# Altium schematic sheet 1_P1.schdoc
size 604 x 431 mm; Symbol: Sheet-Symbol_A2; Device: Sheet-Symbol_A2; @Project Name: LOOK_NT5510_屏幕驱动; @Page Count: 1; @Update Date: 2022-09-19; @Create Date: 2022-08-04; @Schematic Name: Schematic1; @Page No: 1; @Page Name: P1
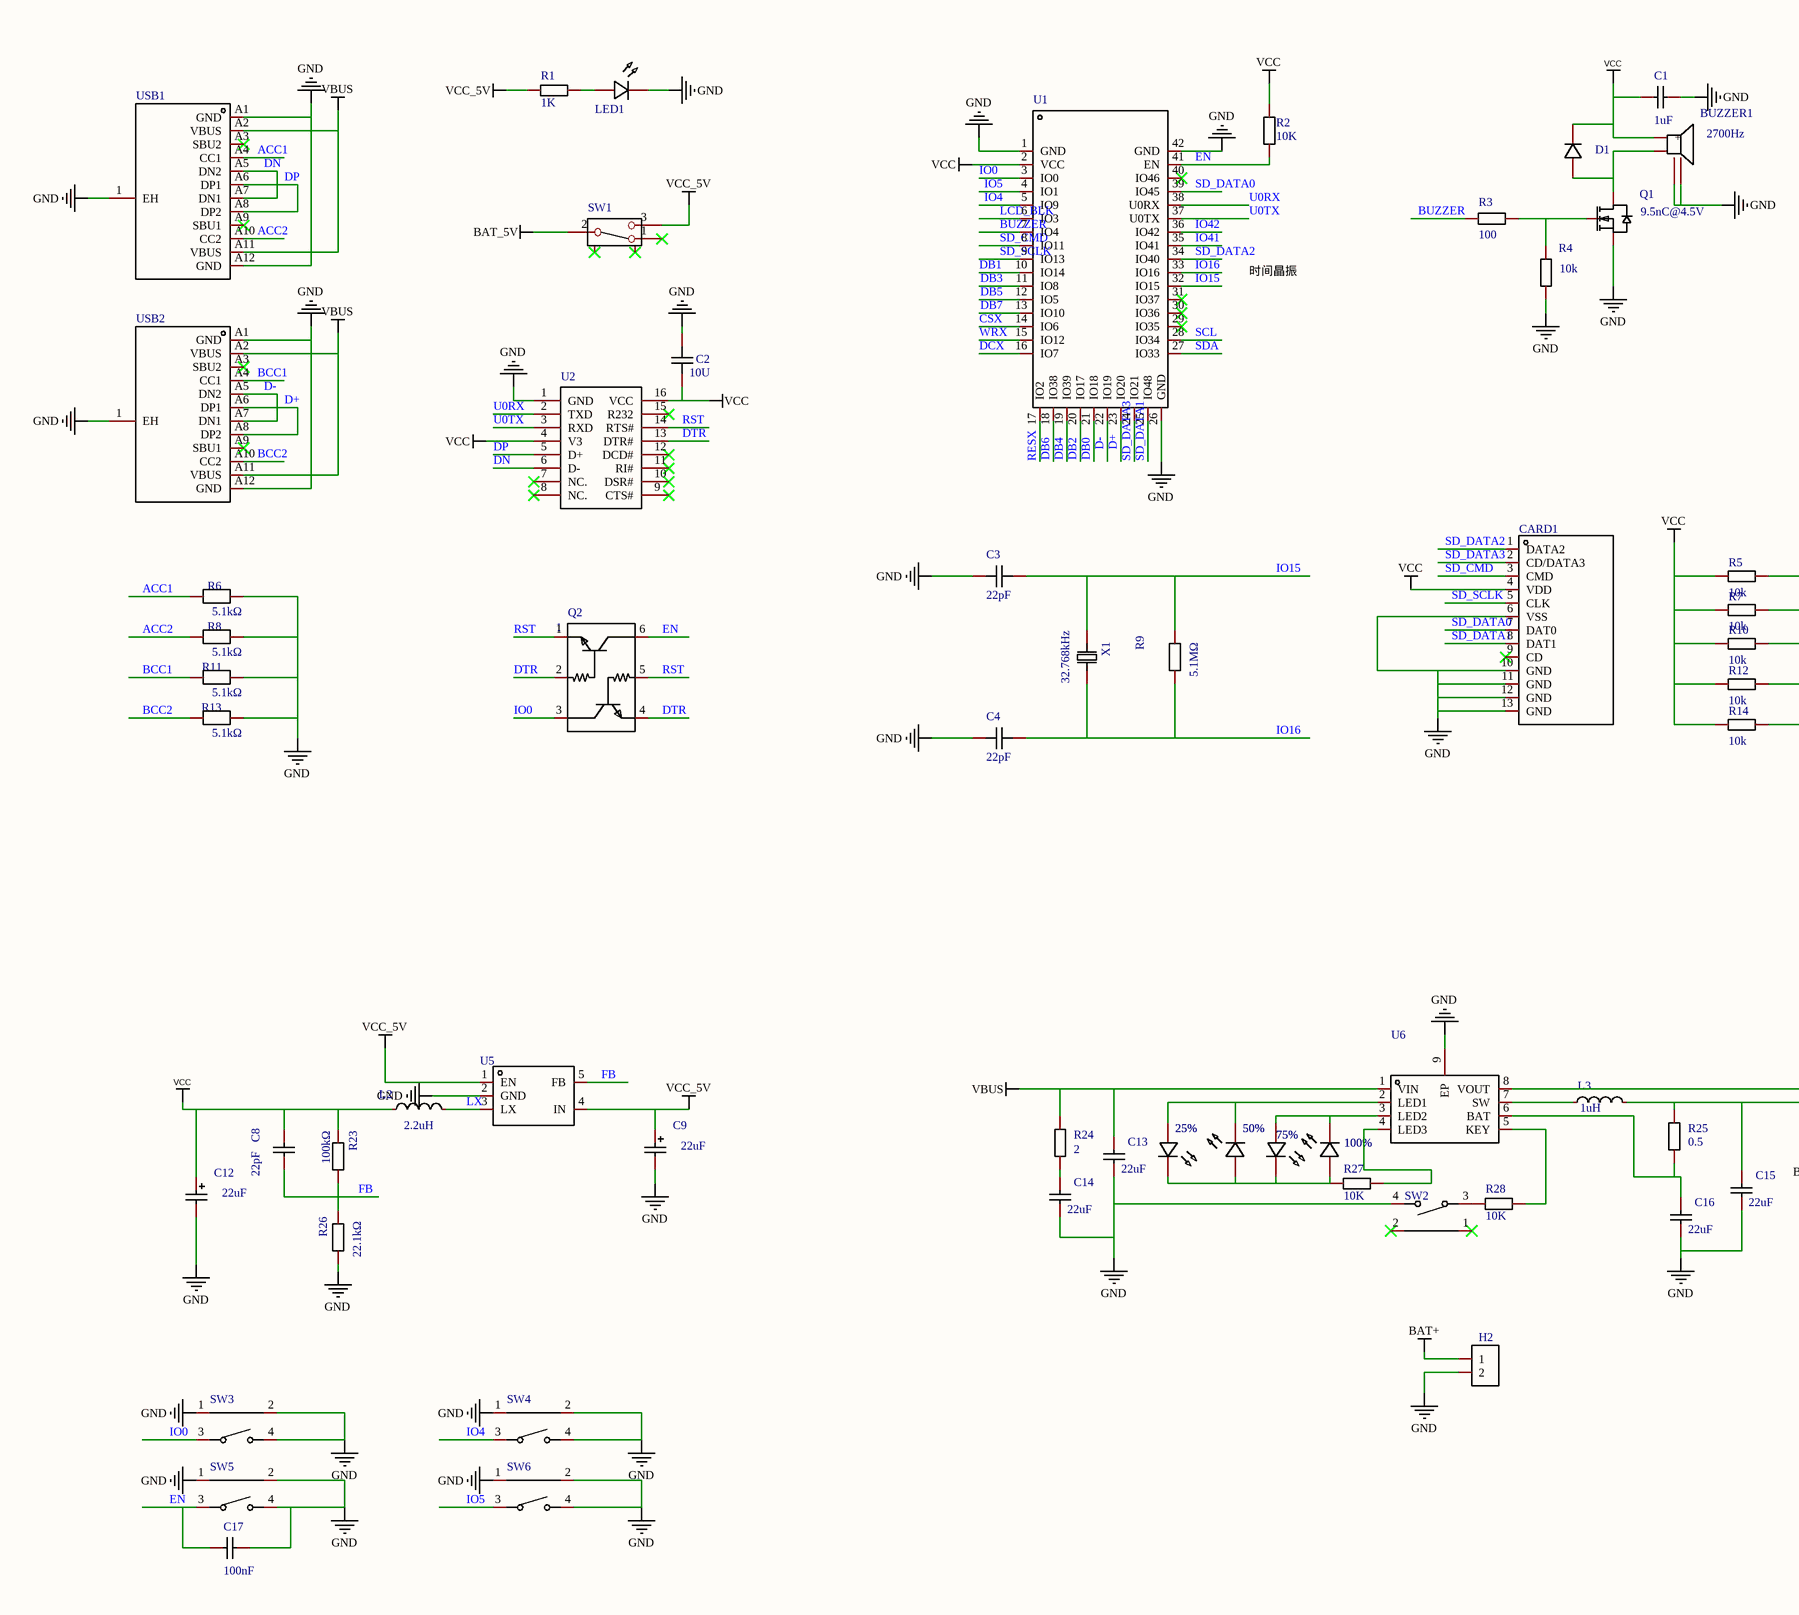
[diagram p0: 1_P1.schdoc, left]
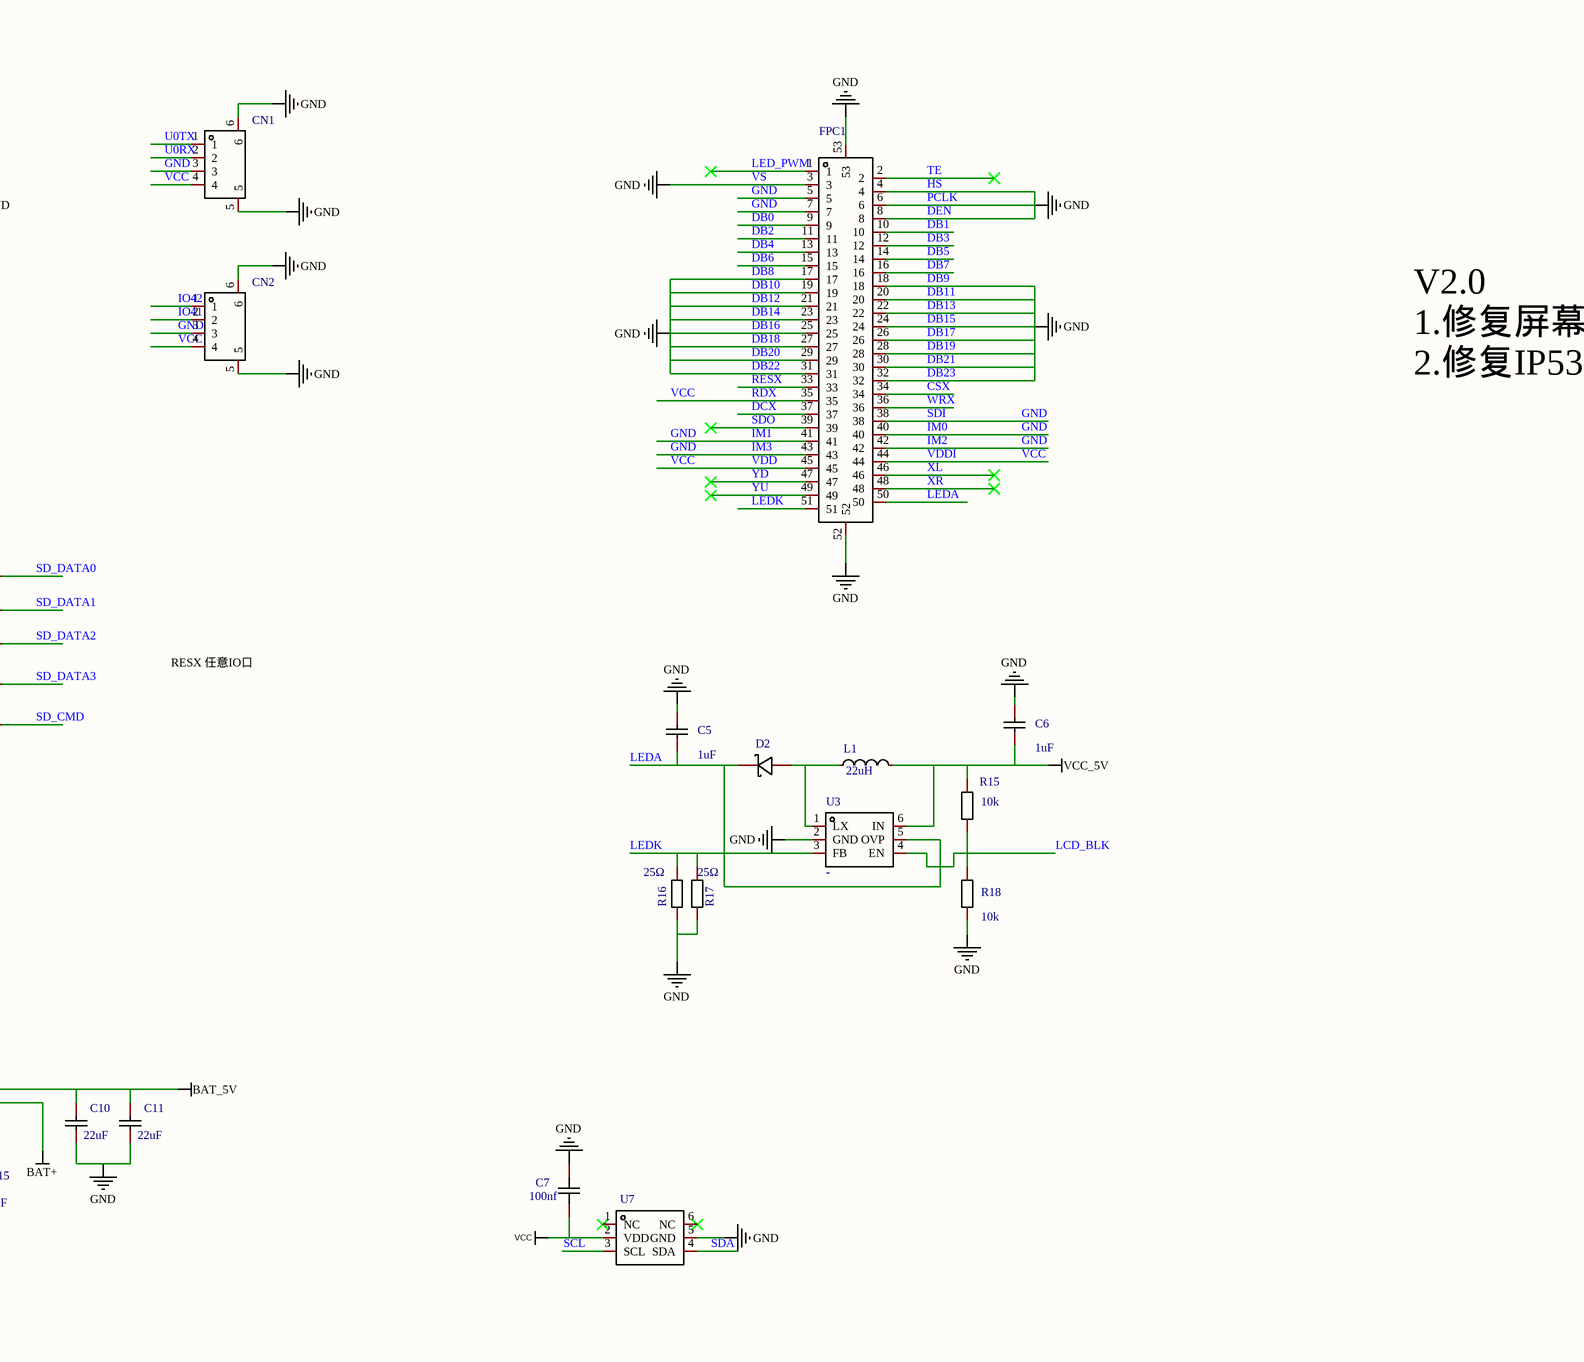
[diagram p1: 1_P1.schdoc, right]

## Parts
BUZZER1  value 2700Hz  [BUZ-SMD_4P-L8.5-W8.5-P8.50-TL]  (hidden comment: MLT-8530)
C1  value 1uF  [C0603]  (hidden comment: CL10A105KO8NNNC)
C2  value 10U  [C0603]  (hidden comment: CAP_0603)
C3  value 22pF  [C0603]  (hidden comment: CAP_0603)
C4  value 22pF  [C0603]  (hidden comment: CAP_0603)
C5  value 1uF  [C0603]  (hidden comment: CL10A105KO8NNNC)
C6  value 1uF  [C0603]  (hidden comment: CL10A105KO8NNNC)
C7  value 100nf  [C0603]  (hidden comment: CAP_0603)
C8  value 22pF  [C0603]  (hidden comment: cc0603jrnpo9bn220)
C9  value 22uF  [CAP-SMD_L3.5-W2.8-R-RD]  (hidden comment: TAJB226K016RNJ)
C10  value 22uF  [C0603]  (hidden comment: CL10A105KO8NNNC)
C11  value 22uF  [C0603]  (hidden comment: CL10A105KO8NNNC)
C12  value 22uF  [CAP-SMD_L3.5-W2.8-R-RD]  (hidden comment: TAJB226K016RNJ)
C13  value 22uF  [C0603]  (hidden comment: CL10A105KO8NNNC)
C14  value 22uF  [C0603]  (hidden comment: CL10A105KO8NNNC)
C15  value 22uF  [C0603]  (hidden comment: CL10A105KO8NNNC)
C16  value 22uF  [C0603]  (hidden comment: CL10A105KO8NNNC)
C17  value 100nF  [C0603]  (hidden comment: 0603B104K500NT)
CARD1  tf-115-bcp9  [TF-SMD_TF-115-BCP9]  (value not drawn)
CN1  PH-4P卧贴  [CONN-SMD_PH2.0-4PWB]  (value not drawn)
CN2  PH-4P卧贴  [CONN-SMD_PH2.0-4PWB]  (value not drawn)
D1  1N4148W  [SOD-123_L2.8-W1.8-LS3.7-RD]  (value not drawn)
D2  SS34  [DO-214AC_L4.3-W2.7-LS5.3-RD]  (value not drawn)
FPC1  FH26W-51S-0.3SHW(60)  [FPC-SMD_FH26W-51S-0.3SHW-60]  (value not drawn)
H2  HDR-F_2.54_1x2P  [HDR-TH_2P-P2.54-V-F]  (value not drawn)
L1  value 22uH  [IND-SMD_L5.0-W5.0]  (hidden comment: SWPA5040S220MT)
L2  value 2.2uH  [IND-SMD_L4.4-W4.2]  (hidden comment: SLO0420H2R2MTT)
L3  value 1uH  [IND-SMD_L7.1-W6.5-P5.60]  (hidden comment: SPM6530T-1R0M120)
LED1  LED_0603-R  [LED0603-RD_BLUE]  (value not drawn)
LED4  100%  [LED0603-RD_BLUE]
LED5  25%  [LED0603-RD_BLUE]
LED6  50%  [LED0603-RD_BLUE]
LED7  75%  [LED0603-RD_BLUE]
Q1  Total Gate Charge (Qg@Vgs): 9.5nC@4.5V  [SOT-23-3_L2.9-W1.3-P1.90-LS2.4-BR]  (hidden comment: AO3400)
Q2  NUMBER: 1  [SC-70-6_L2.2-W1.3-P0.65-LS2.1-BR]  (hidden comment: UMH3N)
R1  value 1K  [R0603]  (hidden comment: Res_0603)
R2  value 10K  [R0603]  (hidden comment: Res_0603)
R3  value 100  [R0603]  (hidden comment: RC0603FR-07100RL)
R4  value 10k  [R0603]  (hidden comment: RC0603FR-0710KL_1)
R5  value 10k  [R0603]  (hidden comment: 0603waf1002t5e)
R6  value 5.1kΩ  [R0603]  (hidden comment: td03g5101bt)
R7  value 10k  [R0603]  (hidden comment: 0603waf1002t5e)
R8  value 5.1kΩ  [R0603]  (hidden comment: td03g5101bt)
R9  value 5.1MΩ  [R0603]  (hidden comment: 0603WAJ0515T5E)
R10  value 10k  [R0603]  (hidden comment: 0603waf1002t5e)
R11  value 5.1kΩ  [R0603]  (hidden comment: td03g5101bt)
R12  value 10k  [R0603]  (hidden comment: 0603waf1002t5e)
R13  value 5.1kΩ  [R0603]  (hidden comment: td03g5101bt)
R14  value 10k  [R0603]  (hidden comment: 0603waf1002t5e)
R15  value 10k  [R0603]  (hidden comment: RC0603FR-0710KL_1)
R16  value 25Ω  [R0603]  (hidden comment: RC0603FR-0710KL_1)
R17  value 25Ω  [R0603]  (hidden comment: RC0603FR-0710KL_1)
R18  value 10k  [R0603]  (hidden comment: RC0603FR-0710KL_1)
R23  value 100kΩ  [R0603]  (hidden comment: rc0603fr-07100kl)
R24  value 2  [R0603]  (hidden comment: 0603waf1002t5e)
R25  value 0.5  [R0603]  (hidden comment: 0603waf1002t5e)
R26  value 22.1kΩ  [R0603]  (hidden comment: 0603waf2212t5e)
R27  value 10K  [R0603]  (hidden comment: 0603waf1002t5e)
R28  value 10K  [R0603]  (hidden comment: 0603waf1002t5e)
SW1  SK-12D02-VG5  [SW-TH_SK-12D02-VG5]  (value not drawn)
SW2  TS24CA  [SW-SMD_TS24CA]  (value not drawn)
SW3  TS24CA  [SW-SMD_TS24CA]  (value not drawn)
SW4  TS24CA  [SW-SMD_TS24CA]  (value not drawn)
SW5  TS24CA  [SW-SMD_TS24CA]  (value not drawn)
SW6  TS24CA  [SW-SMD_TS24CA]  (value not drawn)
U1  ESP-S3-12K  [WIFIM-SMD_42P-L31.0-W18.0-P1.50]  (value not drawn)
U2  CH340C  [SOP-16_L10.0-W3.9-P1.27-LS6.0-BL]  (value not drawn)
U3  RY3730  [SOT-23-6_L2.9-W1.6-P0.95-LS2.8-BL]  (value not drawn)
U5  sy8088aac  [SOT-23-5_L3.0-W1.7-P0.95-LS2.8-BR]  (value not drawn)
U6  IP5306  [ESOP-8_L4.9-W3.9-P1.27-LS6.0-BL-EP]  (value not drawn)
U7  AHT20  [SENSOR-SMD_L3.0-W3.0-P1.00-BR]  (value not drawn)
USB1  TYPE-C-2.0-16PIN-SMT-3  [TYPE-C-SMD_TYPE-CF3.1]  (value not drawn)
USB2  TYPE-C-2.0-16PIN-SMT-3  [TYPE-C-SMD_TYPE-CF3.1]  (value not drawn)
X1  value 32.768kHz  [FC-135R_L3.2-W1.5]  (hidden comment: Q13FC1350000400)

## Nets
BAT+: C15.2 H2.1 L3.2 R25.1
BAT_5V: C10.2 C11.2 SW1.2 U6.8(VOUT)
DB10: BUZZER1.3 BUZZER1.4 C1.2 C2.2 C3.1 C4.1 C5.2 C6.2 C7.1 C9.2 C10.1 C11.1 C12.2 C13.1 C14.1 C15.1 C16.1 C17.2 CARD1.6(VSS) CARD1.10(GND) CARD1.11(GND) CARD1.12(GND) CARD1.13(GND) CN1.3 CN1.5 CN1.6 CN2.3 CN2.5 CN2.6 FPC1.3 FPC1.4 FPC1.5 FPC1.6 FPC1.7 FPC1.8 FPC1.17 FPC1.18 FPC1.19 FPC1.20 FPC1.21 FPC1.22 FPC1.23 FPC1.24 FPC1.25 FPC1.26 FPC1.27 FPC1.28 FPC1.29 FPC1.30 FPC1.31 FPC1.32 FPC1.38 FPC1.40 FPC1.41 FPC1.42 FPC1.43 FPC1.52 FPC1.53 H2.2 LED1.1(C) Q1.2(S) R4.1 R6.1 R8.1 R11.1 R13.1 R16.1 R17.1 R18.1 R26.1 SW2.4 SW3.1 SW3.2 SW3.4 SW4.1 SW4.2 SW4.4 SW5.1 SW5.2 SW5.4 SW6.1 SW6.2 SW6.4 U1.1(GND) U1.26(GND) U1.42(GND) U2.1(GND) U3.2(GND) U5.2(GND) U6.9(EP) U7.5(GND) USB1.1(EH) USB1.A1(GND) USB1.A12(GND) USB2.1(EH) USB2.A1(GND) USB2.A12(GND)  [also labelled DB11, DB12, DB13, DB14, DB15, DB16, DB17, DB18, DB19, DB20, DB21, DB22, DB23, DB8, DB9, DEN, GND, HS, IM0, IM1, IM2, IM3, PCLK, SDI, VS]
RDX: BUZZER1.1(+) C1.1 C2.1 C7.2 C8.2 C12.1 CARD1.4(VDD) CN1.4 CN2.4 D1.1(C) FPC1.35 FPC1.44 FPC1.45 L2.1 R2.2 R5.1 R7.1 R10.1 R12.1 R14.1 R23.1 U1.2(VCC) U2.4(V3) U2.16(VCC) U7.2(VDD)  [also labelled VCC, VDD, VDDI]
VBUS: C13.2 R24.2 U6.1(VIN) USB1.A2(VBUS) USB1.A11(VBUS) USB2.A2(VBUS) USB2.A11(VBUS)
VCC_5V: C6.1 C9.1 L1.2 R1.2 R15.2 SW1.3 U3.6(IN) U5.1(EN) U5.4(IN)
ACC1: R6.2 USB1.A4(CC1)
ACC2: R8.2 USB1.A10(CC2)
BCC1: R11.2 USB2.A4(CC1)
BCC2: R13.2 USB2.A10(CC2)
BUZZER: R3.1 U1.7(IO4)
CSX: FPC1.34 U1.14(IO6)
D+: U1.23(IO20) USB2.A6(DP1) USB2.A8(DP2)
D-: U1.22(IO19) USB2.A5(DN2) USB2.A7(DN1)
DB0: FPC1.9 U1.21(IO18)
DB1: FPC1.10 U1.10(IO14)
DB2: FPC1.11 U1.20(IO17)
DB3: FPC1.12 U1.11(IO8)
DB4: FPC1.13 U1.19(IO39)
DB5: FPC1.14 U1.12(IO5)
DB6: FPC1.15 U1.18(IO38)
DB7: FPC1.16 U1.13(IO10)
DCX: FPC1.37 U1.16(IO7)
DN: U2.6(D-) USB1.A5(DN2) USB1.A7(DN1)
DP: U2.5(D+) USB1.A6(DP1) USB1.A8(DP2)
DTR: Q2.2(B) Q2.4(E) U2.13(DTR#)
EN: C17.1 Q2.6(C) R2.1 SW5.3 U1.41(EN)
FB: C8.1 R23.2 R26.2 U5.5(FB)
IO0: Q2.3(C) SW3.3 U1.3(IO0)
IO4: SW4.3 U1.5(IO9)
IO5: SW6.3 U1.4(IO1)
IO15: C3.2 R9.2 U1.32(IO15) X1.2
IO16: C4.2 R9.1 U1.33(IO16) X1.1
IO41: CN2.2 U1.35(IO41)
IO42: CN2.1 U1.36(IO42)
LCD_BLK: R15.1 R18.2 U1.6(IO3) U3.4(EN)
LED_PWM: FPC1.1
LEDA: C5.1 D2.1(K) FPC1.50 U3.5(OVP)
LEDK: FPC1.51 R16.2 R17.2 U3.3(FB)
LX: L2.2 U5.3(LX)
RESX: FPC1.33 U1.17(IO2)
RST: Q2.1(E) Q2.5(B) U2.14(RTS#)
SCL: U1.28(IO34) U7.3(SCL)
SD_CMD: CARD1.3(CMD) R14.2 U1.8(IO11)
SD_DATA0: CARD1.7(DAT0) R5.2 U1.39(IO45)
SD_DATA1: CARD1.8(DAT1) R7.2 U1.25(IO48)
SD_DATA2: CARD1.1(DATA2) R10.2 U1.34(IO40)
SD_DATA3: CARD1.2(CD/DATA3) R12.2 U1.24(IO21)
SD_SCLK: CARD1.5(CLK) U1.9(IO13)
SDA: U1.27(IO33) U7.4(SDA)
SDO: FPC1.39
TE: FPC1.2
U0RX: CN1.2 U1.38(U0RX) U2.2(TXD)
U0TX: CN1.1 U1.37(U0TX) U2.3(RXD)
WRX: FPC1.36 U1.15(IO12)
XL: FPC1.46
XR: FPC1.48
YD: FPC1.47
YU: FPC1.49
NetBUZZER1_2: BUZZER1.2 D1.2(A) Q1.3(D)
NetC14_2: C14.2 R24.1
NetC16_2: C16.2 R25.2 U6.6(BAT)
NetD2_2: D2.2(A) L1.1 U3.1(LX)
NetL3_1: L3.1 U6.7(SW)
NetLED1_2: LED1.2(A) R1.1
NetLED4_1: LED4.1(C) LED7.2(A) U6.3(LED2)
NetLED4_2: LED4.2(A) LED5.1(C) LED6.2(A) LED7.1(C) R27.2
NetLED5_2: LED5.2(A) LED6.1(C) U6.2(LED1)
NetQ1_1: Q1.1(G) R3.2 R4.2
NetR27_1: R27.1 U6.4(LED3)
NetR28_1: R28.1 U6.5(KEY)
NetR28_2: R28.2 SW2.3

Not connected (* = marked no-connect by the designer): CARD1 9(CD)*; SW1 1* 4* 5*; SW2 1* 2*; U1 29(IO35)* 30(IO36)* 31(IO37)* 40(IO46)*; U2 7(NC.)* 8(NC.)* 9(CTS#)* 10(DSR#)* 11(RI#)* 12(DCD#)* 15(R232)*; U7 1(NC)* 6(NC)*; USB1 A3(SBU2)* A9(SBU1)*; USB2 A3(SBU2)* A9(SBU1)*

## Notes on the sheet
- V2.0
  1.修复屏幕电路过大问题，改为两个25Ω并联(12.5Ω)
  2.修复IP5306第9号引脚现接地
- 时间晶振
- RESX 任意IO口
- 1
- 2
- 3
- 4
- 5
- 6
- A
- B
- C
- D
- Schematic
- Schematic1
- Create Date
- Update Date
- 2022-09-19
- 2022-08-04
- Reviewed
- Drawed
- Page
- P1
- Part Number
- LOOK_NT5510_屏幕驱动
- VER
- SIZE
- PAGE
- OF

## Library data of the parts
BUZZER1 = MLT-8530: 驱动方式:无源(外部驱动);构造类型:电磁式;额定电压:3.6V;工作电压:2.5V~4.5V;频率:2700Hz;声压(SPL):80dB@5V,10cm;长度:8.5mm;宽度:8.5mm;高度:3.3mm;; Manufacturer: 华能; Add into BOM: yes; Technology Type: 电磁式; Rated Voltage: 3.6V; Symbol: MLT-8530; Device: MLT-8530; LCSC Part Name: MLT-8530; Supplier Part: C94599; Manufacturer Part: MLT-8530; Supplier Footprint: SMD; JLCPCB Part Class: Extended Part; Datasheet: https://atta.szlcsc.com/upload/public/pdf/source/20170522/1495448322339.pdf; Supplier: LCSC; Convert to PCB: yes; Oscillator Circuit: 无源(外部驱动); Operating Voltage: 2.5V~4.5V; Sound Pressure Level (SPL): 80dB@5V,10cm; Length: 8.5mm; Width: 8.5mm; Height: 3.3mm
C1 C5 C6 C10 C11 C13-C16 = CL10A105KO8NNNC: 容值:1uF;精度:±10%;额定电压:16V;温度系数:X5R;; Manufacturer: SAMSUNG(三星); Add into BOM: yes; Tolerance: ±10%; Voltage Rated: 16V; Temperature Coefficient: X5R; Symbol: CL10A105KO8NNNC; Device: CL10A105KO8NNNC; LCSC Part Name: 1uF ±10% 16V; Supplier Part: C1592; Manufacturer Part: CL10A105KO8NNNC; Supplier Footprint: 0603; JLCPCB Part Class: Extended Part; Datasheet: https://atta.szlcsc.com/upload/public/pdf/source/20160103/1457707680736.pdf; Supplier: LCSC; Convert to PCB: yes
C2-C4 C7 = CAP_0603: 容值:100nF;精度:±10%;额定电压:50V;温度系数:X7R;; Symbol: C1210X7R475K630NT; Convert to PCB: yes; Device: CAP_0603; Add into BOM: yes; Supplier Footprint: 0603
C8 = cc0603jrnpo9bn220: 容值:22pF;精度:±5%;额定电压:50V;温度系数:NP0;; Manufacturer: YAGEO(国巨); Add into BOM: yes; Tolerance: ±5%; Voltage Rated: 50V; Temperature Coefficient: NP0; Symbol: CC0603JRNPO9BN220; Device: cc0603jrnpo9bn220; LCSC Part Name: 22pF ±5% 50V; Supplier Part: C105620; Manufacturer Part: CC0603JRNPO9BN220; Supplier Footprint: 0603; JLCPCB Part Class: Extended Part; Datasheet: https://atta.szlcsc.com/upload/public/pdf/source/20170425/1493115771353.pdf; Supplier: LCSC; Convert to PCB: yes
C9 C12 = TAJB226K016RNJ: 容值:22uF;精度:±10%;额定电压:16V;等效串联电阻:2.3Ω@100kHz;工作温度:-55~+125;; Manufacturer: Kyocera AVX; Add into BOM: yes; Equivalent Series Resistance(ESR): 2.3Ω 100kHz; Rated Voltage: 16V; Tolerance: ±10%; Symbol: TAJB226K016RNJ; Device: TAJB226K016RNJ; LCSC Part Name: 22uF(226) ±10% 16V; Supplier Part: C8020; Manufacturer Part: TAJB226K016RNJ; Supplier Footprint: CASE-B_3528; JLCPCB Part Class: Extended Part; Datasheet: https://atta.szlcsc.com/upload/public/pdf/source/20160107/1457707749964.pdf; Supplier: LCSC; Convert to PCB: yes; Operating Temperature: -55~+125
C17 = 0603B104K500NT: 容值:100nF;精度:±10%;额定电压:50V;温度系数:X7R;; Manufacturer: FH(风华); Add into BOM: yes; Tolerance: ±10%; Voltage Rated: 50V; Temperature Coefficient: X7R; Symbol: 0603B104K500NT; Device: 0603B104K500NT; LCSC Part Name: 100nF ±10% 50V; Supplier Part: C30926; Manufacturer Part: 0603B104K500NT; Supplier Footprint: 0603; JLCPCB Part Class: Extended Part; Datasheet: https://atta.szlcsc.com/upload/public/pdf/source/20170923/C30926_1506149436298988724.pdf; Supplier: LCSC; Convert to PCB: yes
CARD1 = tf-115-bcp9: 卡连接方式:自弹式;卡类型:MicroSD卡(TF卡);连接器类型:卡座;本体最大高度:1.80mm;触头材质:磷铜;触头镀层:银;工作温度范围:-25~+85;焊接温度(最大值):260;; Manufacturer: XUNPU(讯普); Add into BOM: yes; Card Connection Mode: 自弹式; Connector Type: 卡座; Maximum Body Height: 1.80mm; Welding Temperature (Max): 260; Symbol: TF-115-BCP9; Device: tf-115-bcp9; LCSC Part Name: 自弹式 MicroSD卡(TF卡) 卡座 9P; Supplier Part: C720505; Manufacturer Part: TF-115-BCP9; Supplier Footprint: SMD; JLCPCB Part Class: Extended Part; Datasheet: https://atta.szlcsc.com/upload/public/pdf/source/20210906/DBEC8F03AA1503572333C7CF4A76D0AD.pdf; Supplier: LCSC; Convert to PCB: yes; Card Type: MicroSD卡(TF卡); Contact Material: 磷铜; Contact Plating: 银; Operating Temperature Range: -25~+85
CN1 CN2 = PH-4P卧贴: 参考系列:PH;间距:2mm;插针结构:1x4P;排数:1;每排PIN数:4;行距:-;安装方式:-;触头材质:-;; Manufacturer: BOOMELE(博穆精密); Symbol: PH2.0-4PWB卧式; Add into BOM: yes; Reference Series: PH; Pitch: 2mm; Pins Structure: 1x4P; Number of PINs Per Row: 4; Device: PH-4P卧贴; LCSC Part Name: PH2.0-4PWB  4P 间距2.0mm; Supplier Part: C50137; Manufacturer Part: PH-4P卧贴; Supplier Footprint: SMD,P=2mm; JLCPCB Part Class: Extended Part; Datasheet: https://atta.szlcsc.com/upload/public/pdf/source/20201021/C50137_92282A9B69C22D3BCC62949EB13F278D.pdf; Supplier: LCSC; Convert to PCB: yes; Number of Rows: 1; Row Spacing: -; Mounting Style: -; Contact Material: -
D1 = 1N4148W: 二极管配置:-;功率:400mW;直流反向耐压(Vr):100V;平均整流电流(Io):150mA;正向压降(Vf):1.25V@150mA;反向电流(Ir):1A@75V;反向恢复时间(trr):8ns;工作温度:+125@(Tj);; Manufacturer: MDD; Symbol: 1N4148W-C84367; Add into BOM: yes; Power Dissipation: 400mW; Reverse Voltage (Vr): 100V; Average Rectified Current (Io): 150mA; Reverse Leakage Current: 1A@75V; Reverse Recovery Time (trr): 8ns; Device: 1N4148W; LCSC Part Name: 100V 150mA 8ns; Supplier Part: C84367; Manufacturer Part: 1N4148W; Supplier Footprint: SOD-123; JLCPCB Part Class: Extended Part; Datasheet: https://atta.szlcsc.com/upload/public/pdf/source/20190305/C84367_BC79FE6E21776C7B65D97776F82EAC81.pdf; Supplier: LCSC; Convert to PCB: yes; Diode Configuration: -; Forward Voltage (Vf@If): 1.25V@150mA; Operating Temperature: +125@(Tj)
D2 = SS34: 40V,3A,VF=0.55V 3A; Manufacturer: MDD; Symbol: SS34_C8678; Add into BOM: yes; Device: SS34; LCSC Part Name: SS34; Supplier Part: C8678; Manufacturer Part: SS34; Supplier Footprint: SMA(DO-214AC); Datasheet: https://atta.szlcsc.com/upload/public/pdf/source/20220408/D0396E57A6E83C6AFC0ED25EC9EDE030.pdf; Supplier: LCSC; Convert to PCB: yes
FPC1 = FH26W-51S-0.3SHW(60): 间距:0.3mm;触点数量:51;锁定特性:翻盖式;安装类型:卧贴;触点类型:下接;; Manufacturer: HRS(广濑); Add into BOM: yes; Pitch: 0.3mm; Number of Contacts: 51; Locking Feature: 翻盖式; FFC, FCB Thickness: 0.2mm; Symbol: FH26W-51S-0.3SHW(60); Device: FH26W-51S-0.3SHW(60); LCSC Part Name: 0.3mm P数:51 翻盖式 下接 FH26系列前翻盖; Supplier Part: C424656; Manufacturer Part: FH26W-51S-0.3SHW(60); Supplier Footprint: SMD,P=0.3mm; JLCPCB Part Class: Extended Part; Datasheet: https://atta.szlcsc.com/upload/public/pdf/source/20190903/C424656_D2E092DD7837435C9BCFC7F31FBBE750.pdf; Supplier: LCSC; Convert to PCB: yes; Mounting Type: 卧贴; Contact Type: 下接; Height Above Board: 1mm
H2 = HDR-F_2.54_1x2P: Symbol: Header-Female-2.54_1x2; Convert to PCB: yes; Device: HDR-F_2.54_1x2P; Add into BOM: yes; Supplier Part: C49661; Supplier Footprint: 插件
L1 = SWPA5040S220MT: 额定电流:1.5A;精度:±20%;直流电阻(DCR):168mΩ;电感值:22uH;; Manufacturer: Sunlord(顺络); Add into BOM: yes; Rated Current: 1.5A; Tolerance: ±20%; DC Resistance (DCR): 168mΩ; Symbol: SWPA5040S220MT; Device: SWPA5040S220MT; LCSC Part Name: 22uH ±20%; Supplier Part: C68434; Manufacturer Part: SWPA5040S220MT; Supplier Footprint: SMD; JLCPCB Part Class: Extended Part; Datasheet: https://atta.szlcsc.com/upload/public/pdf/source/20161024/1477287969319.pdf; Supplier: LCSC; Convert to PCB: yes; Length: 5mm; Height: 4mm; Width: 5mm
L2 = SLO0420H2R2MTT: 电感值:2.2uH;精度:±20%;额定电流:3A;直流电阻(DCR):42m;; Manufacturer: Sunltech(韩国顺磁); Add into BOM: yes; Tolerance: ±20%; Rated Current: 3A; DC Resistance (DCR): 42m; Symbol: SLO0420H2R2MTT; Device: SLO0420H2R2MTT; LCSC Part Name: 2.2uH ±20% 3A 42m; Supplier Part: C207828; Manufacturer Part: SLO0420H2R2MTT; Supplier Footprint: SMD; JLCPCB Part Class: Extended Part; Datasheet: https://atta.szlcsc.com/upload/public/pdf/source/20180412/C207828_0C22E525A5F58264854728DEF786A504.pdf; Supplier: LCSC; Convert to PCB: yes
L3 = SPM6530T-1R0M120: 直流电阻(DCR):7.81mΩ;精度:±20%;电感值:1uH;额定电流:13A;; Manufacturer: TDK; Add into BOM: yes; DC Resistance (DCR): 7.81mΩ; Tolerance: ±20%; Rated Current: 13A; Symbol: SPM6530T-1R0M120; Device: SPM6530T-1R0M120; LCSC Part Name: 1.0uH ±20%; Supplier Part: C87572; Manufacturer Part: SPM6530T-1R0M120; Supplier Footprint: SMD; JLCPCB Part Class: Extended Part; Datasheet: https://atta.szlcsc.com/upload/public/pdf/source/20161112/1478931670973.pdf; Supplier: LCSC; Convert to PCB: yes; Width: 6.5mm; Height: 3mm; Length: 7.1mm
LED1 LED4-LED7 = LED_0603-R: 发光颜色:红灯;二极管配置:-;透镜颜色:无色透明;主波长:617.5nm;峰值波长:632nm;色温:-;光通量(25时):-;测试电流:5mA;正向电压(VF):2.2V;发光强度:28.5mcd;功率:60mW;发光角度:120°;安装方式:-;工作温度:-40~+85;; Symbol: LED_R; Convert to PCB: yes; Device: LED_0603-R; Add into BOM: yes; Supplier Footprint: 0603; Supplier Part: C72044
  LED4: Name: 100%
  LED5: Name: 25%
  LED6: Name: 50%
  LED7: Name: 75%
Q1 = AO3400: 类型:N沟道;漏源电压(Vdss):30V;连续漏极电流(Id):5.8A;功率(Pd):1.4W;导通电阻(RDS(on)@Vgs,Id):28mΩ@10V,2.9A;阈值电压(Vgs(th)@Id):900mV@250uA;栅极电荷(Qg@Vgs):9.5nC@4.5V;输入电容(Ciss@Vds):623pF@15V;反向传输电容(Crss@Vds):77pF@15V;工作温度:-55~+150@(Tj);; Manufacturer: LGE(鲁光); Symbol: AO3400_C841146; Add into BOM: yes; Type: N沟道; Drain Source Voltage (Vdss): 30V; Continuous Drain Current (Id): 5.8A; Power Dissipation (Pd): 1.4W; Device: AO3400; LCSC Part Name: N沟道 30V 5.8A; Supplier Part: C841146; Manufacturer Part: AO3400; Supplier Footprint: SOT-23; JLCPCB Part Class: Extended Part; Datasheet: https://atta.szlcsc.com/upload/public/pdf/source/20200922/C841146_922AA0BEFDBB3A3B608547560AFF8EA3.pdf; Supplier: LCSC; Convert to PCB: yes; Drain Source On Resistance (RDS(on)@Vgs,Id): 28mΩ@10V,2.9A; Gate Threshold Voltage (Vgs(th)@Id): 900mV@250uA; Input Capacitance (Ciss@Vds): 623pF@15V; Reverse Transfer Capacitance (Crss@Vds): 77pF@15V; Operating Temperature: -55~+150@(Tj)
Q2 = UMH3N: 晶体管类型:2个NPN-预偏置;功率(Pd):150mW;集电极电流(Ic):100mA;集射极击穿电压(Vceo):50V;; Manufacturer: CJ(江苏长电/长晶); Add into BOM: yes; Power Dissipation (Pd): 150mW; Collector Current (Ic): 100mA; Collector-Emitter Breakdown Voltage (Vceo): 50V; Symbol: UMH3N; Device: UMH3N; LCSC Part Name: 2个NPN-预偏置 100mA 50V; Supplier Part: C62892; Manufacturer Part: UMH3N; Supplier Footprint: SC-70-6(SOT-363); JLCPCB Part Class: Extended Part; Datasheet: https://atta.szlcsc.com/upload/public/pdf/source/20151109/1457707575095.pdf; Supplier: LCSC; Convert to PCB: yes; Transistor Type: 2个NPN-预偏置
R1 R2 = Res_0603: Symbol: 电阻; Convert to PCB: yes; Device: Res_0603; Add into BOM: yes; Supplier Footprint: 0603
R3 = RC0603FR-07100RL: 电阻类型:厚膜电阻;阻值:100;精度:±1%;功率:100mW;温度系数:±100ppm/;最大工作电压:75V;工作温度范围:-55~+155;; Manufacturer: YAGEO(国巨); Add into BOM: yes; Tolerance: ±1%; Power(Watts): 100mW; Overload Voltage (Max): 75V; Symbol: RC0603FR-07100RL; Device: RC0603FR-07100RL; LCSC Part Name: 100 ±1%; Supplier Part: C105588; Manufacturer Part: RC0603FR-07100RL; Supplier Footprint: 0603; JLCPCB Part Class: Extended Part; Datasheet: https://atta.szlcsc.com/upload/public/pdf/source/20170428/1493376742308.pdf; Supplier: LCSC; Convert to PCB: yes; Type: 厚膜电阻; Temperature Coefficient: ±100ppm/; Operating Temperature Range: -55~+155
R4 R15-R18 = RC0603FR-0710KL_1: 阻值:10k;精度:±1%;功率:100mW;温度系数:±100ppm/;最大工作电压:75V;工作温度范围:-55~+155;; Manufacturer: YAGEO(国巨); Add into BOM: yes; Tolerance: ±1%; Power(Watts): 100mW; Overload Voltage (Max): 75V; Symbol: RC0603FR-0710KL; Device: RC0603FR-0710KL_1; LCSC Part Name: 10k ±1%; Supplier Part: C98220; Manufacturer Part: RC0603FR-0710KL; LCSC On Sale: 1; Supplier Footprint: 0603; JLCPCB On Sale: 1; Datasheet: https://atta.szlcsc.com/upload/public/pdf/source/20170522/1495423494387.pdf; Supplier: LCSC; Convert to PCB: yes; Temperature Coefficient: ±100ppm/; Operating Temperature Range: -55~+155; JLCPCB Part Class: Extended Part
R5 R7 R10 R12 R14 R24 R25 R27 R28 = 0603waf1002t5e: 电阻类型:厚膜电阻;阻值:10k;精度:±1%;功率:1/10W;温度系数:±100ppm/;最大工作电压:75V;工作温度范围:-55~+155;; Manufacturer: UNI-ROYAL(厚声); Add into BOM: yes; Tolerance: ±1%; Power(Watts): 1/10W; Overload Voltage (Max): 75V; Symbol: 0603WAF1002T5E; Device: 0603waf1002t5e; LCSC Part Name: 10k ±1%; Supplier Part: C25804; Manufacturer Part: 0603WAF1002T5E; Supplier Footprint: 0603; JLCPCB Part Class: Basic Part; Datasheet: https://atta.szlcsc.com/upload/public/pdf/source/20200306/C422600_1E6D84923E4A46A82E41ADD87F860B5C.pdf; Supplier: LCSC; Convert to PCB: yes; Type: 厚膜电阻; Temperature Coefficient: ±100ppm/; Operating Temperature Range: -55~+155
R6 R8 R11 R13 = td03g5101bt: 温度系数:±25ppm/℃;精度:±0.1%;功率:100mW;阻值:5.1kΩ;最大工作电压:50V;工作温度范围:-55℃~+155℃;; Manufacturer: FH(风华); Add into BOM: yes; Tolerance: ±0.1%; Power(Watts): 100mW; Overload Voltage (Max): 50V; NAME: 1; Symbol: TD03G5101BT; Device: td03g5101bt; LCSC Part Name: 5.1KΩ(5101) ±0.1% 1/10W; Supplier Part: C667001; Manufacturer Part: TD03G5101BT; Supplier Footprint: 0603; JLCPCB Part Class: Extended Part; Datasheet: https://atta.szlcsc.com/upload/public/pdf/source/20200616/C657321_2CFA27FA726BC0D0F6223AF922169515.pdf; Supplier: LCSC; Convert to PCB: yes; Temperature Coefficient: ±25ppm/℃; Operating Temperature Range: -55℃~+155℃; NUMBER: 1
R9 = 0603WAJ0515T5E: 电阻类型:厚膜电阻;阻值:5.1MΩ;精度:±5%;功率:1/10W;温度系数:±100ppm/℃;最大工作电压:75V;工作温度范围:-55℃~+155℃;; Manufacturer: UNI-ROYAL(厚声); Add into BOM: yes; Tolerance: ±5%; Power(Watts): 1/10W; Overload Voltage (Max): 75V; Symbol: 0603WAJ0515T5E; Device: 0603WAJ0515T5E; LCSC Part Name: 5.1MΩ ±5%; Supplier Part: C20089; Manufacturer Part: 0603WAJ0515T5E; Supplier Footprint: 0603; JLCPCB Part Class: Extended Part; Datasheet: https://atta.szlcsc.com/upload/public/pdf/source/20200306/C422600_1E6D84923E4A46A82E41ADD87F860B5C.pdf; Supplier: LCSC; Convert to PCB: yes; Type: 厚膜电阻; Temperature Coefficient: ±100ppm/℃; Operating Temperature Range: -55℃~+155℃
R23 = rc0603fr-07100kl: 阻值:100kΩ;精度:±1%;功率:100mW;温度系数:±100ppm/℃;最大工作电压:75V;工作温度范围:-55℃~+155℃;; Manufacturer: YAGEO(国巨); Add into BOM: yes; Tolerance: ±1%; Power(Watts): 100mW; Overload Voltage (Max): 75V; Symbol: RC0603FR-07100KL; Device: rc0603fr-07100kl; LCSC Part Name: 100kΩ ±1%; Supplier Part: C14675; Manufacturer Part: RC0603FR-07100KL; Supplier Footprint: 0603; JLCPCB Part Class: Extended Part; Datasheet: https://atta.szlcsc.com/upload/public/pdf/source/20140324/1457707028752.pdf; Supplier: LCSC; Convert to PCB: yes; Temperature Coefficient: ±100ppm/℃; Operating Temperature Range: -55℃~+155℃
R26 = 0603waf2212t5e: 电阻类型:厚膜电阻;阻值:22.1kΩ;精度:±1%;功率:1/10W;温度系数:±100ppm/℃;最大工作电压:75V;工作温度范围:-55℃~+155℃;; Manufacturer: UNI-ROYAL(厚声); Add into BOM: yes; Tolerance: ±1%; Power(Watts): 1/10W; Overload Voltage (Max): 75V; Symbol: 0603WAF2212T5E; Device: 0603waf2212t5e; LCSC Part Name: 22.1kΩ ±1%; Supplier Part: C25961; Manufacturer Part: 0603WAF2212T5E; Supplier Footprint: 0603; JLCPCB Part Class: Extended Part; Datasheet: https://atta.szlcsc.com/upload/public/pdf/source/20200306/C422600_1E6D84923E4A46A82E41ADD87F860B5C.pdf; Supplier: LCSC; Convert to PCB: yes; Type: 厚膜电阻; Temperature Coefficient: ±100ppm/℃; Operating Temperature Range: -55℃~+155℃
SW1 = SK-12D02-VG5: 额定电流(DC):-;额定电压(DC):-;额定电流(AC):-;额定电压(AC):-;电路结构:单刀双掷;安装方式:卧插;机械寿命:5000;滑钮形状:矩形柱状;引脚样式:PC引脚;工作温度:-25~+70;开关高度:9.5mm;; Manufacturer: 韩国韩荣; Add into BOM: yes; Circuit: 单刀双掷; Mechanical Life: 5000; Actuator Style: 矩形柱状; Pin Style: PC引脚; Switch Height: 9.5mm; Symbol: SK-12D02-VG5; Device: SK-12D02-VG5; LCSC Part Name: SK-12D02-VG5; Supplier Part: C136722; Manufacturer Part: SK-12D02-VG5; Supplier Footprint: 插件; JLCPCB Part Class: Extended Part; Datasheet: https://atta.szlcsc.com/upload/public/pdf/source/20180731/C136723_39114FC09BF2E9DC98823B78B7234B45.pdf; Supplier: LCSC; Convert to PCB: yes; Current Rating (DC): -; Voltage Rating (DC): -; Current Rating (AC): -; Voltage Rating (AC): -; Mounting Style: 卧插; Operating Temperature: -25~+70
SW2-SW6 = TS24CA: 触点电流:50mA;额定电压(DC):12V;电路结构:单刀单掷;安装方式:卧贴;按钮形状:矩形按钮;带灯:-;开关长度:4.55mm;开关宽度:1.8mm;开关高度:3.5mm;; Manufacturer: SHOU HAN(首韩); Add into BOM: yes; Contact Current: 50mA; Voltage Rating (DC): 12V; Circuit: 单刀单掷; Actuator Style: 矩形按钮; Switch Length: 4.55mm; Switch Width: 1.8mm; Switch Height: 3.5mm; Symbol: TS24CA; Device: TS24CA; LCSC Part Name: 2*4*3.5半包小贝贝TS-018小侧按键m165蓝牙耳机轻触开关; Supplier Part: C393942; Manufacturer Part: TS24CA; Supplier Footprint: SMD; JLCPCB Part Class: Extended Part; Datasheet: https://atta.szlcsc.com/upload/public/pdf/source/20190521/C393942_591A9E318887EFA4274D34029981AD99.pdf; Supplier: LCSC; Convert to PCB: yes; Mounting Style: 卧贴; With Lamp: -
U1 = ESP-S3-12K: Add into BOM: yes; Symbol: ESP-S3-12K; Device: ESP-S3-12K; LCSC Part Name: ESP-S3-12K; Supplier Part: C9900013902; Manufacturer Part: ESP-S3-12K; Supplier Footprint: ESP32-S3-12K; JLCPCB Part Class: Extended Part; Datasheet: https://atta.szlcsc.comnull; Supplier: LCSC; Convert to PCB: yes
U2 = CH340C: 类型:Transceiver;协议类别:USB 2.0;驱动器/接收器数:-;数据速率:2Mbps;; Manufacturer: WCH(南京沁恒); Add into BOM: yes; Protocol: USB 2.0; Data Rate: 2Mbps; Supply Voltage: 3.3V, 5V; Symbol: CH340C; Device: CH340C; LCSC Part Name: CH340C; Supplier Part: C84681; Manufacturer Part: CH340C; Supplier Footprint: SOP-16_150mil; JLCPCB Part Class: Extended Part; Datasheet: https://atta.szlcsc.com/upload/public/pdf/source/20200819/C84681_ADBED554CE321879DBD6B1D06488689C.pdf; Supplier: LCSC; Convert to PCB: yes; Type: Transceiver; Number of Drivers/Receivers: -
U3 = RY3730: 类型:-;拓扑结构:-;内部开关:-;供电电压（最低）:-;供电电压（最高）:-;频率:-;; Manufacturer: RYCHiP(蕊源); Add into BOM: yes; Symbol: RY3730; Device: RY3730; LCSC Part Name: RY3730 WLED Driver, 2.5-5.5V, 8Series WLED Driver, 1.2MHz, SOT23-6; Supplier Part: C370887; Manufacturer Part: RY3730; Supplier Footprint: SOT-23-6; JLCPCB Part Class: Extended Part; Datasheet: https://atta.szlcsc.com/upload/public/pdf/source/20190329/C370887_F149D316440A2ABDFE08FA1E0696DEE8.pdf; Supplier: LCSC; Convert to PCB: yes; Type: -; Topology: -; Internal Switch(s): -; Number of Outputs: -; Supply Voltage (Min): -; Supply Voltage (Max): -; Output Voltage: -; Output / Channel Current: -; Dimming Control: -; Value: -; Operating Temperature: -
U5 = sy8088aac: 功能类型:降压型;同步整流:-;输出通道数:-;拓扑结构:-;输入电压:-;输出电流(最大值):-;开关频率:-;; Manufacturer: 矽力杰silergy; Manufacturer Part: 3.; Add into BOM: yes; Function: 降压型; Symbol: SY8088AAC; Device: sy8088aac; LCSC Part Name: 降压型; Supplier Part: C79313; Supplier Footprint: SOT-23-5; JLCPCB Part Class: Extended Part; Datasheet: https://atta.szlcsc.com/upload/public/pdf/source/20170329/1490752163260.pdf; Supplier: LCSC; Convert to PCB: yes; Synchronous Rectification: -; Number of Outputs: -; Topology: -; Input Voltage: -; Output Current (Max): -; Switching Frequency: -
U6 = IP5306: 充电电池的类型:-;电池单元组数:-;最大充电电流:-;充满的电池组电压:-;最大供应电压:-;; Manufacturer: INJOINIC(英集芯); Add into BOM: yes; Symbol: IP5306; Device: IP5306; LCSC Part Name: IP5306; Supplier Part: C181692; Manufacturer Part: IP5306; Supplier Footprint: ESOP-8; JLCPCB Part Class: Extended Part; Datasheet: https://atta.szlcsc.com/upload/public/pdf/source/20180920/C181692_842C9BF636DF123BB66E91FC1AD6F13F.pdf; Supplier: LCSC; Convert to PCB: yes; Battery Chemistry: -; Number of Cells: -; Charge Current - Max: -; Battery Pack Voltage: -; Voltage - Supply (Max): -; Interface: -
U7 = AHT20: Manufacturer: 广州奥松; Symbol: AHT20_C2757850; Add into BOM: yes; Name: AHT20; Device: AHT20; LCSC Part Name: AHT20; Supplier Part: C2757850; Manufacturer Part: AHT20; Supplier Footprint: SMD; JLCPCB Part Class: 扩展库; Datasheet: https://atta.szlcsc.com/upload/public/pdf/source/20200407/C503357_487829B2F97386053400E2E73B0ABB4D.pdf; Supplier: LCSC; Convert to PCB: yes
USB1 USB2 = TYPE-C-2.0-16PIN-SMT-3: 连接器类型:Type-C;标准:USB 2.0;公母:母座;触点数量:16;端口数量:1;安装方式:卧贴;额定电流 - 电源:3A;工作温度范围:-40~+85;; Manufacturer: CIKI(皓富); Add into BOM: yes; Connector Type: Type-C; Gender: 母座; Number of Contacts: 16; Number of Ports: 1; Current Rating - Power (Max): 3A; Symbol: TYPE-C-2.0-16PIN-SMT-3; Device: TYPE-C-2.0-16PIN-SMT-3; LCSC Part Name: Type-C 母座 卧贴; Supplier Part: C2987386; Manufacturer Part: TYPE-C-2.0-16PIN-SMT-3; Supplier Footprint: SMD; JLCPCB Part Class: Extended Part; Datasheet: https://atta.szlcsc.com/upload/public/pdf/source/20220407/B142FF2CEB5FE873AECDBA4AD709657C.pdf; Supplier: LCSC; Convert to PCB: yes; Standard: USB 2.0; Mounting Style: 卧贴; Operating Temperature Range: -40~+85
X1 = Q13FC1350000400: 晶振类型:贴片无源晶振;频率:32.768kHz;频率公差:±20ppm;频率稳定度:-;负载电容:12.5pF;等效串联电阻(ESR):70kΩ;工作温度:-40℃~+85℃;; Manufacturer: EPSON(爱普生); Add into BOM: yes; Crystal Type: 贴片无源晶振; Frequency Tolerance: ±20ppm; Load Capacitance: 12.5pF; Equivalent Series Resistance (ESR): 70kΩ; Symbol: Q13FC1350000400; Device: Q13FC1350000400; LCSC Part Name: 32.768kHz ±20ppm 12.5pF; Supplier Part: C32346; Manufacturer Part: Q13FC1350000400; Supplier Footprint: SMD3215-2P; JLCPCB Part Class: Basic Part; Datasheet: https://atta.szlcsc.com/upload/public/pdf/source/20190108/C32346_746D6B07EAF90824457A96480007685F.pdf; Supplier: LCSC; Convert to PCB: yes; Frequency Stability: -; Operating Temperature: -40℃~+85℃